# EAGLE design dmo (EAGLE 6.6.0)
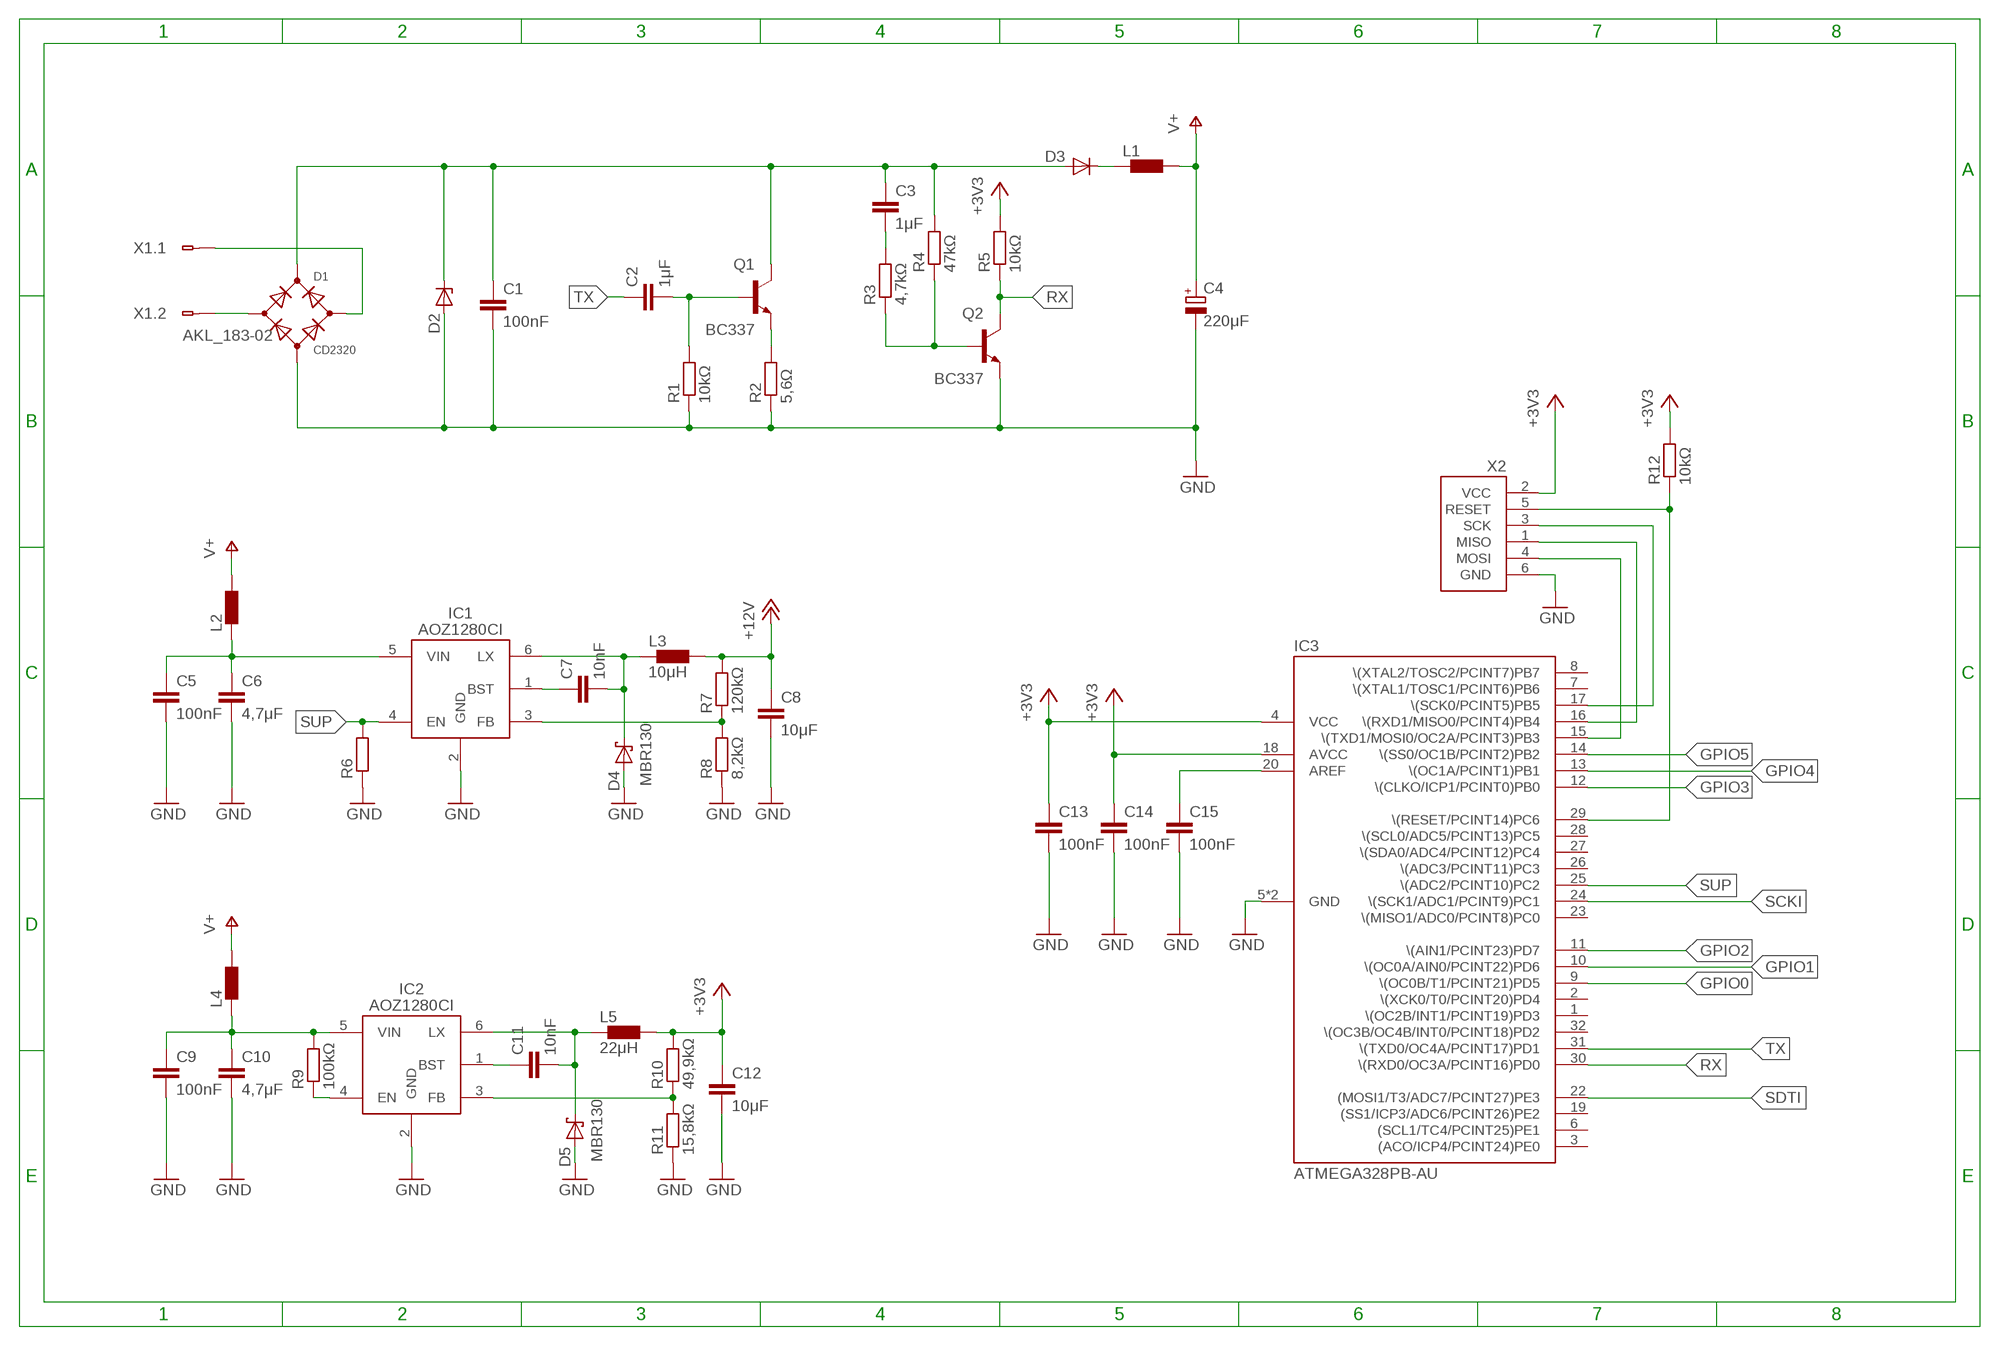
[diagram p0: schematic, sheet 1]

## Parts
C1  100nF  C_1206  [CHIP_1206]
C2  1μF  C_1206  [CHIP_1206]
C3  1μF  C_1206  [CHIP_1206]
C4  220μF  C_EL_E5-13  [E5-13]
C5  100nF  C_0805  [CHIP_0805]
C6  4,7μF  C_1206  [CHIP_1206]
C7  10nF  C_0603  [CHIP_0603]
C8  10μF  C_1206  [CHIP_1206]
C9  100nF  C_0805  [CHIP_0805]
C10  4,7μF  C_1206  [CHIP_1206]
C11  10nF  C_0603  [CHIP_0603]
C12  10μF  C_1206  [CHIP_1206]
C13  100nF  C_0603  [CHIP_0603]
C14  100nF  C_0603  [CHIP_0603]
C15  100nF  C_0603  [CHIP_0603]
D1  CD2320  [2320]
D2  Z-DIODE-SOD123  [SOD123]
D3  DIODE-SOD123  [SOD123]
D4  MBR130  SHOTKY-DIODE-SOD123  [SOD123]
D5  MBR130  SHOTKY-DIODE-SOD123  [SOD123]
IC1  AOZ1280CI  [SOT23-6_095]
IC2  AOZ1280CI  [SOT23-6_095]
IC3  ATMEGA328PB-AU  [QFP32_08]
L1  L_0805  [CHIP_0805]
L2  L_0805  [CHIP_0805]
L3  10μH  L_1210  [CHIP_1210]
L4  L_0805  [CHIP_0805]
L5  22μH  L_0805  [CHIP_0805]
Q1  BC337  NPN-SOT23-BEC  [SOT23]
Q2  BC337  NPN-SOT23-BEC  [SOT23]
R1  10kΩ  R_0603  [CHIP_0603]
R2  5,6Ω  R_1206  [CHIP_1206]
R3  4,7kΩ  R_0603  [CHIP_0603]
R4  47kΩ  R_0603  [CHIP_0603]
R5  10kΩ  R_0603  [CHIP_0603]
R6  R_0603  [CHIP_0603]
R7  120kΩ  R_0603  [CHIP_0603]
R8  8,2kΩ  R_0603  [CHIP_0603]
R9  100kΩ  R_0603  [CHIP_0603]
R10  49,9kΩ  R_0603  [CHIP_0603]
R11  15,8kΩ  R_0603  [CHIP_0603]
R12  10kΩ  R_0603  [CHIP_0603]
X1  AKL_183-02  [AKL_183-02]
X2  ISP-AVR6  [ML6]

## Nets
+3V3: C12.1 C13.1 C14.1 IC3.4(VCC) IC3.18(AVCC) L5.1 R5.2 R10.2 R12.2 X2.2(VCC)
+12V: C8.1 L3.1 R7.2
GND: C1.2 C4.- C5.2 C6.2 C8.2 C9.2 C10.2 C12.2 C13.2 C14.2 C15.2 D1.- D2.A D4.A D5.A IC1.2(GND) IC2.2(GND) IC3.5(GND) IC3.21(GND) Q2.2(E) R1.1 R2.1 R6.1 R8.1 R11.1 X2.6(GND)
GPIO0: IC3.9(\(OC0B/T1/PCINT21)PD5)
GPIO1: IC3.10(\(OC0A/AIN0/PCINT22)PD6)
GPIO2: IC3.11(\(AIN1/PCINT23)PD7)
GPIO3: IC3.12(\(CLKO/ICP1/PCINT0)PB0)
GPIO4: IC3.13(\(OC1A/PCINT1)PB1)
GPIO5: IC3.14(\(SS0/OC1B/PCINT2)PB2)
N$1: IC3.16(\(RXD1/MISO0/PCINT4)PB4) X2.1(MISO)
N$2: IC3.15(\(TXD1/MOSI0/OC2A/PCINT3)PB3) X2.4(MOSI)
N$3: D3.K L1.2
N$4: IC3.17(\(SCK0/PCINT5)PB5) X2.3(SCK)
N$5: IC3.29(\(RESET/PCINT14)PC6) R12.1 X2.5(RESET)
N$6: IC2.4(EN) R9.1
N$7: C11.1 IC2.1(BST)
N$8: C11.2 D5.K IC2.6(LX) L5.2
N$9: IC2.3(FB) R10.1 R11.2
N$10: C9.1 C10.1 IC2.5(VIN) L4.2 R9.2
N$11: C7.1 IC1.1(BST)
N$12: C7.2 D4.K IC1.6(LX) L3.2
N$13: IC1.3(FB) R7.1 R8.2
N$14: C5.1 C6.1 IC1.5(VIN) L2.2
N$15: C15.1 IC3.20(AREF)
N$16: Q1.2(E) R2.2
N$17: C2.2 Q1.1(B) R1.2
N$18: Q2.1(B) R3.1 R4.1
N$19: C3.2 R3.2
N$20: D1.AC2 X1.1
N$22: D1.AC1 X1.2
RX: IC3.30(\(RXD0/OC3A/PCINT16)PD0) Q2.3(C) R5.1
SCKI: IC3.24(\(SCK1/ADC1/PCINT9)PC1)
SDTI: IC3.22((MOSI1/T3/ADC7/PCINT27)PE3)
SUP: IC1.4(EN) IC3.25(\(ADC2/PCINT10)PC2) R6.2
TX: C2.1 IC3.31(\(TXD0/OC4A/PCINT17)PD1)
V+: C4.+ L1.1 L2.1 L4.1
VCC: C1.1 C3.1 D1.+ D2.K D3.A Q1.3(C) R4.2
Unconnected: IC3.1(\(OC2B/INT1/PCINT19)PD3) IC3.2(\(XCK0/T0/PCINT20)PD4) IC3.3((ACO/ICP4/PCINT24)PE0) IC3.6((SCL1/TC4/PCINT25)PE1) IC3.7(\(XTAL1/TOSC1/PCINT6)PB6) IC3.8(\(XTAL2/TOSC2/PCINT7)PB7) IC3.19((SS1/ICP3/ADC6/PCINT26)PE2) IC3.23(\(MISO1/ADC0/PCINT8)PC0) IC3.26(\(ADC3/PCINT11)PC3) IC3.27(\(SDA0/ADC4/PCINT12)PC4) IC3.28(\(SCL0/ADC5/PCINT13)PC5) IC3.32(\(OC3B/OC4B/INT0/PCINT18)PD2)

## Library data of the parts
C1-C3 C5-C15 = passiv:C_: CAPACITOR, European symbol
C4 = passiv:C_EL_: POLARIZED CAPACITOR, European symbol
D1 = gleichrichter:CD2320: SMD Gleichrichter Datasheet: cd2320.pdf <./eagle/doc/gleichrichter/cd2320.pdf>
D2 = diode:Z-DIODE
D3 = diode:DIODE
D4 D5 = diode:SHOTKY-DIODE
IC1 IC2 = ic-dc_dc:AOZ1280CI: Stepdown Wandler Datasheet: aoz1280ci.pdf <./eagle/doc/ic-dc_dc/aoz1280ci.pdf>
IC3 = ic-mcu:ATMEGA*8PB: Microcontroller Typ Flash SRAM EEPROM GPIO ADC DAC PWM Timer Ports ATmega48PB <./eagle/doc/ic-mcu/atmega48pb_88pb_168pb.pdf> 4kB 512B 256B 23 8x 10bit 4x 8bit, 2x 16bit 2x 8bit, 1x 16bit JTAG, 2x USART, 2x I2C, 2x SPI ATmega88PB <./eagle/doc/ic-mcu/atmega48pb_88pb_168pb.pdf> 8kB 1kB 512B 23 8x 10bit 4x 8bit, 2x 16bit 2x 8bit, 1x 16bit JTAG, 2x USART, 2x I2C, 2x SPI ATmega168PB <./eagle/doc/ic-mcu/atmega48pb_88pb_168pb.pdf> 16kB 1kB 512B 23 8x 10bit 4x 8bit, 2x 16bit 2x 8bit, 1x 16bit JTAG, 2x USART, 2x I2C, 2x SPI ATmega328PB <./eagle/doc/ic-mcu/atmega328pb.pdf> 32kB 2kB 1kB 23 8x 10bit 4x 8bit, 2x 16bit 2x 8bit, 1x 16bit JTAG, 2x USART, 2x I2C, 2x SPI
L1-L5 = passiv:L_: INDUCTOR, European symbol
Q1 Q2 = transistor:NPN: NPN Transistor Typ Variant VCEO (V) IC (mA) PD (mW) Source BC337 TO92x-EBC 45 800 625 bc337_338.pdf <./eagle/doc/transistor/bc337_338.pdf> BC546 TO92x-EBC 65 100 625 bc546.pdf <./eagle/doc/transistor/bc546.pdf> BC817 SOT23-BEC 45 500 250 bc817.pdf <./eagle/doc/transistor/bc817.pdf> BD543 TO220x-BCE 40 10A 70W bd543.pdf <./eagle/doc/transistor/bd543.pdf>
R1-R12 = passiv:R_: RESISTOR, European symbol
X1 = anschluss:AKL_183-02: Anschlussklemme Datasheet: akl181-183.pdf <./eagle/doc/anschluss/akl181-183.pdf> Gegenstück: AKL169
X2 = stecker:ISP

## Board
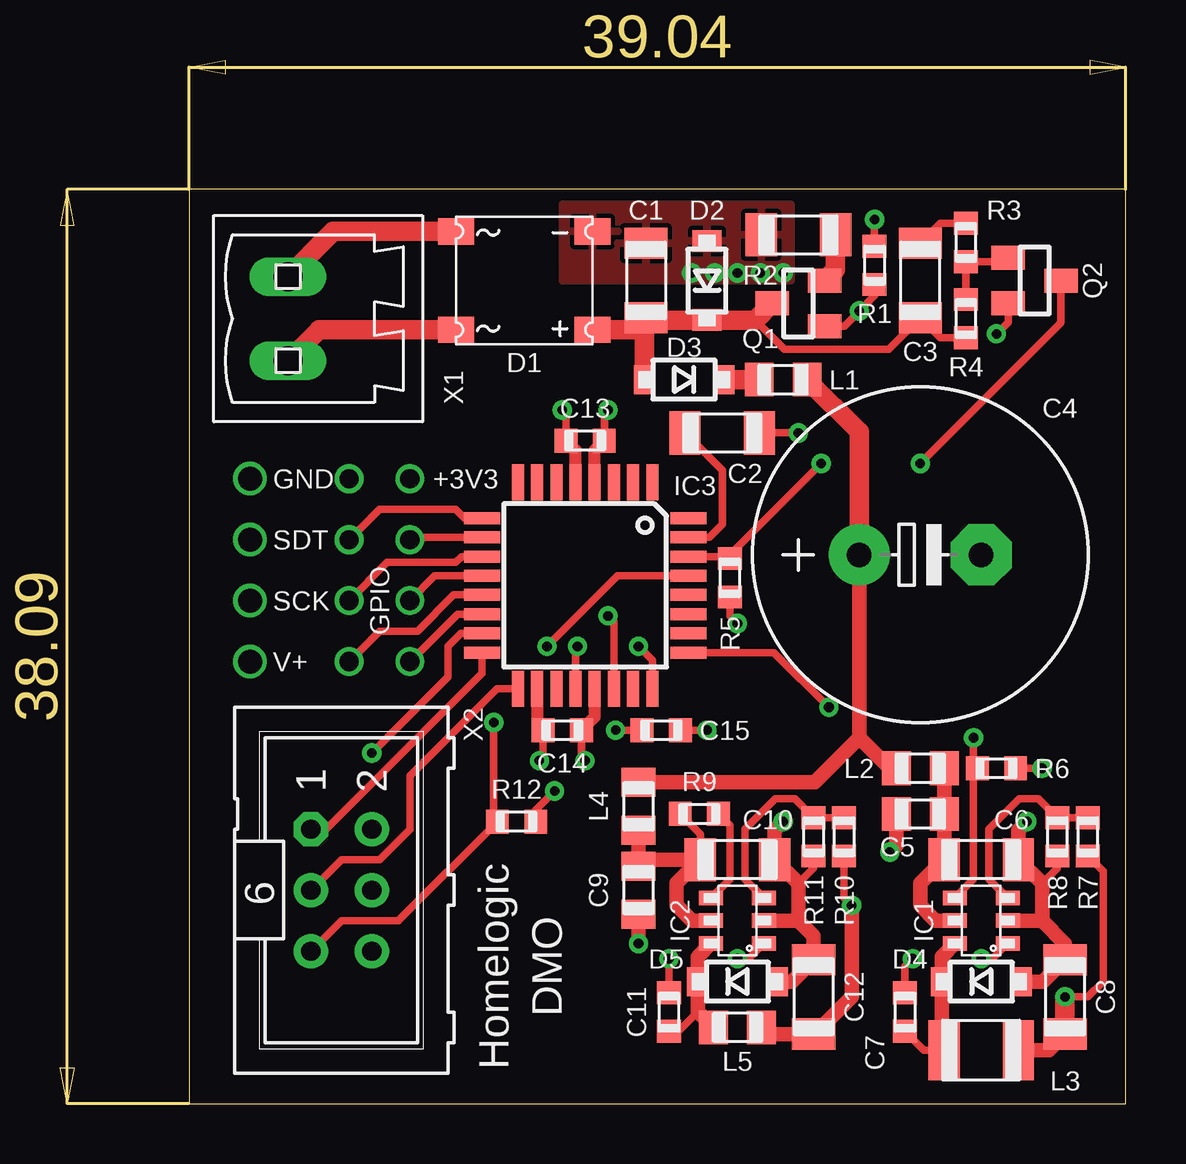
[diagram p1: board, top side]
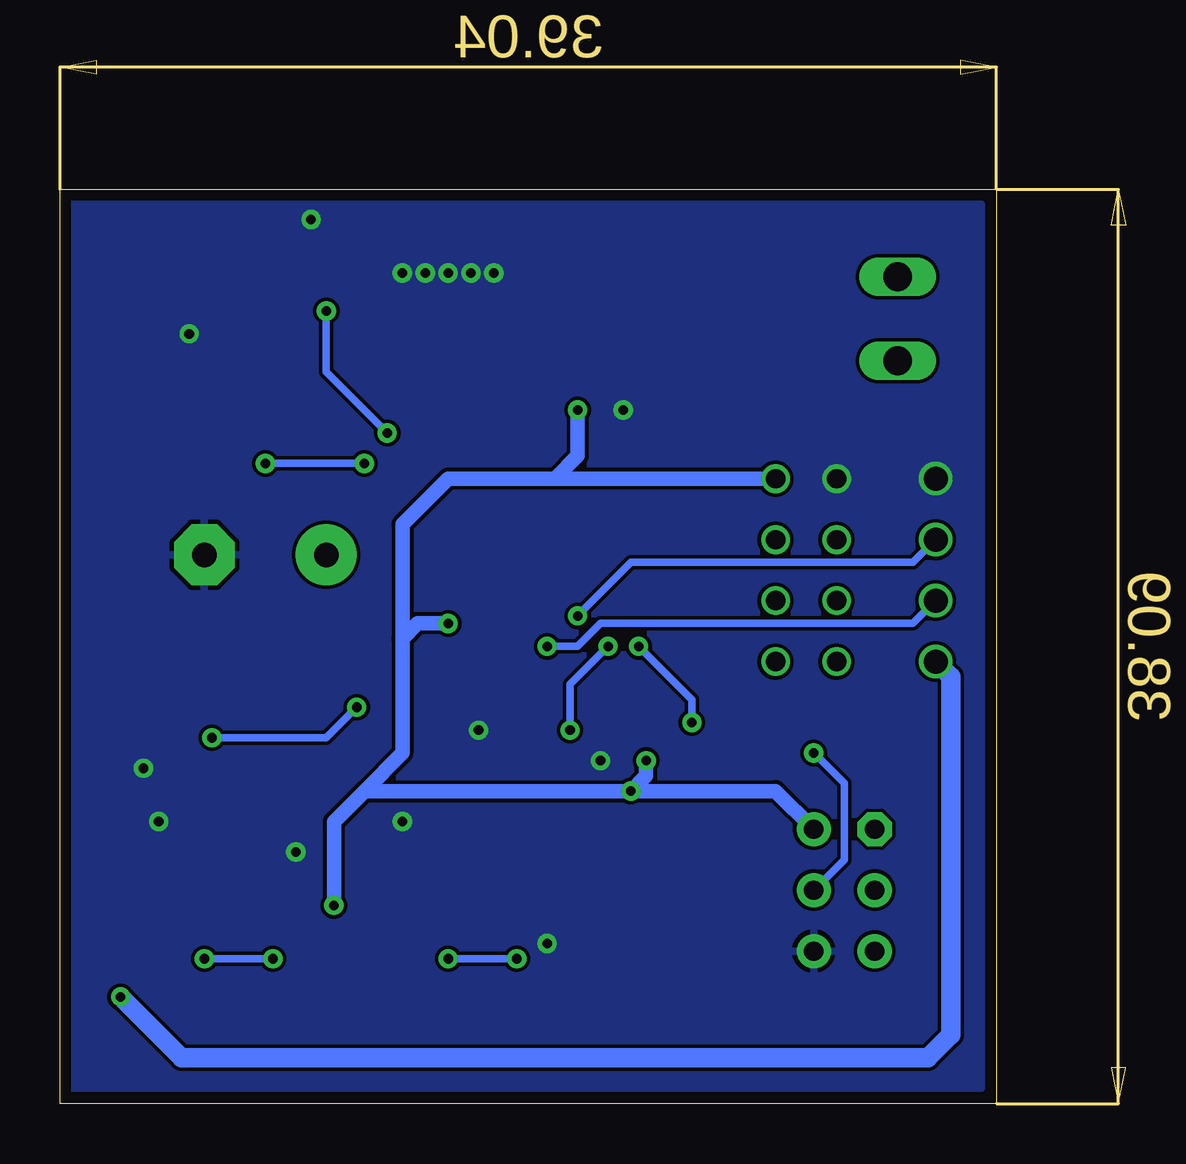
[diagram p2: board, bottom side, seen from below]

Size 39.04 x 38.09 mm. Coordinates in mm from the lower left corner, seen from the top.
Outline: 0,0 39.04,0 39.04,38.09 0,38.09 0,0
Copper layers (1*16): Top 0.018mm / dielectric 1.55mm / Bottom 0.018mm
Design rules "eC-STANDARD_pool-2-layer  *": minimum track width 0.15mm, minimum drill 0.25mm, track to track 0.15mm, track to pad 0.15mm, pad to pad 0.15mm, via to via 0.15mm, smd to smd 0.15mm, copper to edge 0.45mm, drill to drill 0.3mm, minimum pad ring 0.2mm, minimum via ring 0.2mm, stop-mask expansion 0.1mm, vias tented up to drill 0.5mm, thermal gap 0.2mm

### Footprints (pad centres in the part's own frame; a part is rotated, then mirrored left to right if it is on the bottom)
CHIP_1206 = smd 1.3 x 1.8: 1 -1.55,0; 2 1.55,0
E5-13 = drill 1.016 pad 2.54: + -2.54,0 | drill 1.016 pad 2.54 octagon: - 2.54,0
CHIP_0805 = smd 1.2 x 1.4: 1 -1,0; 2 1,0
CHIP_0603 = smd 0.95 x 1: 1 -0.8,0; 2 0.8,0
2320 = smd 1.5 x 1.1: + 2.85,-2.05; - 2.85,2.05; AC1 -2.85,2.05; AC2 -2.85,-2.05
SOD123 = smd 0.9 x 1.2: A 1.65,0; K -1.65,0
SOT23-6_095 = smd 0.6 x 1: 1 -0.95,-1.1; 2 0,-1.1; 3 0.95,-1.1; 4 0.95,1.1; 5 0,1.1; 6 -0.95,1.1
QFP32_08 = smd 1.5 x 0.5: 1 -4.3,2.8; 2 -4.3,2; 3 -4.3,1.2; 4 -4.3,0.4; 5 -4.3,-0.4; 6 -4.3,-1.2; 7 -4.3,-2; 8 -4.3,-2.8; 17 4.3,-2.8; 18 4.3,-2; 19 4.3,-1.2; 20 4.3,-0.4; 21 4.3,0.4; 22 4.3,1.2; 23 4.3,2; 24 4.3,2.8 | smd 0.5 x 1.5: 9 -2.8,-4.3; 10 -2,-4.3; 11 -1.2,-4.3; 12 -0.4,-4.3; 13 0.4,-4.3; 14 1.2,-4.3; 15 2,-4.3; 16 2.8,-4.3; 25 2.8,4.3; 26 2,4.3; 27 1.2,4.3; 28 0.4,4.3; 29 -0.4,4.3; 30 -1.2,4.3; 31 -2,4.3; 32 -2.8,4.3
CHIP_1210 = smd 1.3 x 2.5: 1 -1.55,0; 2 1.55,0
SOT23 = smd 1 x 1.4: 1 -0.95,-1.1; 2 0.95,-1.1; 3 0,1.1
AKL_183-02 = drill 1.2 long: 1 -1.75,0; 2 1.75,0
ML6 = drill 0.8 pad 1.422 octagon: 1 -2.54,-1.27 | drill 0.8 pad 1.422: 2 -2.54,1.27; 3 0,-1.27; 4 0,1.27; 5 2.54,-1.27; 6 2.54,1.27

### Placement (x,y rotation side)
C1  19.05,34.29 90 top
C2  22.23,27.94 0 top
C3  30.48,34.29 90 top
C4  30.48,22.86 0 top
C5  30.48,12.06 180 top
C6  33.02,10.16 0 top
C7  29.84,3.81 270 top
C8  36.51,4.45 90 top
C9  18.73,8.89 270 top
C10  22.86,10.16 0 top
C11  20,3.81 270 top
C12  26.04,4.45 90 top
C13  16.51,27.62 180 top
C14  15.56,15.56 0 top
C15  19.68,15.56 0 top
D1  13.97,34.29 0 top
D2  21.59,34.29 90 top
D3  20.64,30.16 180 top
D4  33.02,5.08 0 top
D5  22.86,5.08 0 top
IC1  33.02,7.62 90 top
IC2  22.86,7.62 90 top
IC3  16.51,21.59 270 top
L1  24.77,30.16 180 top
L2  30.48,13.97 0 top
L3  33.02,2.22 180 top
L4  18.73,12.38 270 top
L5  22.86,3.17 180 top
Q1  25.4,33.34 90 top
Q2  35.24,34.29 270 top
R1  28.57,34.92 270 top
R2  25.4,36.2 0 top
R3  32.38,35.88 90 top
R4  32.38,32.7 270 top
R5  22.54,21.91 270 top
R6  33.66,13.97 180 top
R7  37.47,11.11 270 top
R8  36.2,11.11 90 top
R9  21.27,12.06 180 top
R10  27.3,11.11 270 top
R11  26.04,11.11 90 top
R12  13.65,11.75 0 top
X1  4.13,32.7 90 top
X2  6.35,8.89 270 top

### Tracks (layer width: path | path; a pad name or v marks a point on that pad's centre or on a via)
+3V3  (via drill 0.4, 0.8)
  Top 0.305: C14.1 14.76,14.44 v14.61,14.29 | C13.1 17.31,28.74 v17.46,28.89 | v27.62,8.26 27.3,8.57 R10.2 | R5.2 22.54,20.32 v22.86,20 | R12.2 14.45,12.23 v15.24,13.02
  Top 0.508: IC3.4 16.91,27.22 C13.1 | IC3.18 14.51,15.8 C14.1
  Top 0.61: L5.1 24.14,2.9 C12.1 26.07,2.9 27.62,4.45 v27.62,8.26
  Bottom 0.61: X2.2 9.21,13.02 v15.24,13.02 | v27.62,8.26 27.62,11.75 26.35,13.02 | 26.35,13.02 v15.24,13.02 | v14.61,14.29 14.61,13.65 v15.24,13.02 | 24.77,19.37 24.77,24.13 22.86,26.04 18.41,26.04 | 24.77,19.37 24.77,14.61 26.35,13.02 | v22.86,20 24.13,20 24.77,19.37 | v9.21,26.04 18.41,26.04 | v17.46,28.89 17.46,26.99 18.41,26.04
+12V  (via drill 0.4, 1)
  Top 0.305: R7.2 38.1,9.68 38.1,5.08 37.47,4.45 v36.51,4.45
  Top 0.61: L3.1 35.84,2.22 C8.1
  Top 0.813: v36.51,4.45 C8.1
  Bottom 0.813: v2.54,18.41 1.91,17.78 1.91,2.86 2.86,1.91 33.97,1.91 v36.51,4.45
GND  (via drill 0.4, 0.8, 1)
  Top 0.305: R11.1 26.04,9.8 25.4,9.17 | R8.1 36.2,9.8 35.56,9.17 | R1.1 v28.57,36.83 | R6.1 v35.56,13.97 | Q2.2 34.14,32.55 v33.66,32.07 | C14.2 16.36,14.44 v16.51,14.29 | C13.2 15.71,28.74 v15.56,28.89 | C15.2 v21.59,15.56
  Top 0.508: IC3.5 16.11,27.22 C13.2 | IC3.21 16.91,16.11 C14.2
  Top 0.61: D5.A 25.12,5.08 C12.2 26.04,6.99 25.4,7.62 | IC2.2 25.4,7.62 | 25.4,7.62 25.4,9.17 C10.2 24.41,11.39 v24.77,11.75 | 35.56,7.62 IC1.2 | 35.56,7.62 35.56,9.17 C6.2 34.57,11.39 v34.92,11.75 | 35.56,7.62 36.51,6.67 C8.2 35.6,5.08 D4.A | C9.2 v18.73,6.67 | C5.2 29.48,10.75 v29.21,10.48
  other vias: 24.77,34.61 23.81,34.61 22.86,34.61 21.91,34.61 20.95,34.61 2.54,26.04 6.67,26.04
  pour Bottom: 0.64,37.47 38.73,37.47 38.73,0.64 0.64,0.64
  pour Top: 15.56,37.47 25.08,37.47 25.08,34.29 15.56,34.29
GPIO0  (via drill 0.8)
  Top 0.305: IC3.9 11.49,24.39 11.11,24.77 7.94,24.77 v6.67,23.5
GPIO1  (via drill 0.8)
  Top 0.305: IC3.10 9.3,23.59 v9.21,23.5
GPIO2  (via drill 0.8)
  Top 0.305: IC3.11 11.36,22.79 11.11,22.54 8.26,22.54 v6.67,20.95
GPIO3  (via drill 0.8)
  Top 0.305: IC3.12 10.24,21.99 v9.21,20.95
GPIO4  (via drill 0.8)
  Top 0.305: IC3.13 11.03,21.19 9.53,19.68 7.94,19.68 v6.67,18.41
GPIO5  (via drill 0.8)
  Top 0.305: IC3.14 11.18,20.39 v9.21,18.41
N$1
  Top 0.305: IC3.16 12.21,17.93 5.71,11.43 X2.1
N$2  (via drill 0.4)
  Top 0.305: IC3.15 11.34,19.59 10.79,19.05 10.79,17.78 v7.62,14.61
  Bottom 0.305: v7.62,14.61 6.35,13.34 6.35,10.16 X2.4
N$3
  Top 0.813: D3.K L1.2
N$4
  Top 0.305: X2.3 6.35,10.16 7.94,10.16 9.21,11.43 9.21,13.65 12.85,17.29 IC3.17
N$5  (via drill 0.4)
  Top 0.305: X2.5 6.35,7.62 8.74,7.62 8.74,7.63 R12.1 12.7,11.9 v12.7,15.88 | IC3.29 17.86,21.99 v14.92,19.05
  Bottom 0.305: v12.7,15.88 12.7,16.83 v14.92,19.05
N$6
  Top 0.305: IC2.4 22.54,9.35 22.54,11.6 R9.1
N$7  (via drill 0.4)
  Top 0.305: IC2.1 23.32,6.03 v22.86,6.03 | v20,6.03 C11.1
  Bottom 0.305: v22.86,6.03 v20,6.03
N$8
  Top 0.305: C11.2 20.39,3.01 21.21,3.83
  Top 0.61: IC2.6 21.21,6.12 D5.K 21.21,3.83 L5.2
N$9
  Top 0.305: IC2.3 23.18,9.35 23.18,11.43 24.45,12.7 25.25,12.7 R11.2 R10.1
N$10
  Top 0.305: R9.2 21.31,11.23 C10.1
  Top 0.61: IC2.5 20.95,7.62 20.32,8.26 20.32,9.17 C10.1 19,10.16 C9.1 L4.2
N$11  (via drill 0.4)
  Top 0.305: IC1.1 33.48,6.03 v33.02,6.03 | v30.16,6.03 29.84,5.71 C7.1
  Bottom 0.305: v33.02,6.03 v30.16,6.03
N$12
  Top 0.305: C7.2 30.63,2.22 L3.2
  Top 0.61: IC1.6 31.37,6.12 D4.K 31.37,2.32 L3.2
N$13
  Top 0.305: IC1.3 33.34,9.35 33.34,11.43 34.61,12.7 35.41,12.7 R8.2 R7.1
N$14
  Top 0.61: IC1.5 31.11,7.62 30.48,8.26 30.48,9.17 C6.1 C5.1 L2.2
N$15  (via drill 0.4)
  Top 0.305: v17.78,15.56 C15.1 | IC3.20 16.11,18.97 v16.19,19.05
  Bottom 0.305: v17.78,15.56 17.78,17.46 v16.19,19.05
N$16
  Top 0.813: R2.2 26.95,34.74 Q1.2
N$17  (via drill 0.4)
  Top 0.305: C2.2 v25.4,27.94 | Q1.1 27.31,32.39 v27.94,33.02 28.57,33.66 R1.2
  Bottom 0.305: v25.4,27.94 27.94,30.48 v27.94,33.02
N$18
  Top 0.305: R4.1 R3.1 33.98,35.08 Q2.1
N$19
  Top 0.305: R3.2 31.32,36.68 C3.2
N$20
  Top 0.813: X1.1 5.42,32.24 D1.AC2
N$22
  Top 0.813: X1.2 6.01,36.34 D1.AC1
RX  (via drill 0.4)
  Top 0.305: Q2.3 36.34,32.53 v30.48,26.67 | IC3.30 22.47,22.79 | 22.47,22.79 v26.35,26.67 | R5.1 22.47,22.79
  Bottom 0.305: v30.48,26.67 v26.35,26.67
SCKI  (via drill 0.4, 1)
  Top 0.305: v18.73,19.05 19.31,18.47 IC3.24
  Bottom 0.305: v18.73,19.05 17.46,19.05 16.51,20 3.49,20 v2.54,20.95
SDTI  (via drill 0.4, 1)
  Top 0.305: IC3.22 17.71,20.07 v17.46,20.32
  Bottom 0.305: v2.54,23.5 3.49,22.54 15.24,22.54 v17.46,20.32
SUP  (via drill 0.4)
  Top 0.305: IC1.4 32.7,9.35 32.7,13.82 R6.2 32.7,14.12 v32.7,15.24 | IC3.25 24.39,18.79 v26.67,16.51
  Bottom 0.305: v26.67,16.51 27.94,15.24 v32.7,15.24
TX
  Top 0.305: IC3.31 21.68,23.59 22.23,24.13 22.23,26.39 C2.1
V+
  Top 0.61: C4.+ 27.94,15.24 | 27.94,15.24 29.21,13.97 L2.1 | L4.1 26.08,13.38 27.94,15.24
  Top 0.813: L1.1 27.94,27.99 C4.+
VCC
  Top 0.305: R4.2 31.32,31.9 C3.1 29.17,31.43 24.81,31.43 23.6,32.64
  Top 0.813: D1.+ 18.55,32.24 C1.1 | C1.1 19.15,32.64 D2.K 23.6,32.64 Q1.3 | D3.A 18.99,32.68 C1.1

### Text on the board
tNames: GND | +3V3 | SDT | SCK | GPIO | V+ | Homelogic | DMO